# EAGLE design ESP07 Breakout (EAGLE 6.5.0)
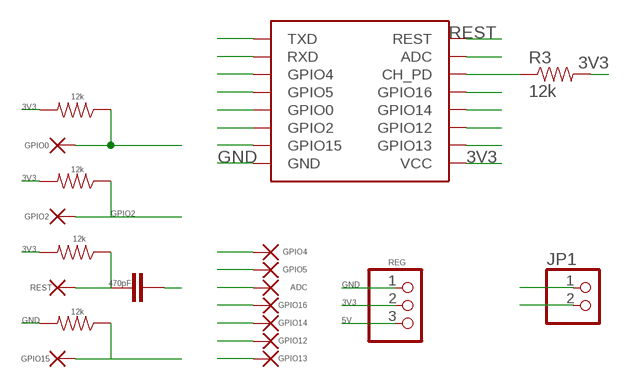
[diagram p0: schematic, sheet 1]

## Parts
ADC  1,6/0,8  [1,6/0,8]
C1  470pF  CAP0603-CAP  [0603-CAP]
GPIO0  1,6/0,8  [1,6/0,8]
GPIO2  1,6/0,8  [1,6/0,8]
GPIO4  1,6/0,8  [1,6/0,8]
GPIO5  1,6/0,8  [1,6/0,8]
GPIO12  1,6/0,8  [1,6/0,8]
GPIO13  1,6/0,8  [1,6/0,8]
GPIO14  1,6/0,8  [1,6/0,8]
GPIO15  1,6/0,8  [1,6/0,8]
GPIO16  1,6/0,8  [1,6/0,8]
JP1  PINHD-1X2/90  [1X02/90]
R1  12k  RESISTOR0603-RES  [0603-RES]
R2  12k  RESISTOR0603-RES  [0603-RES]
R3  12k  RESISTOR0603-RES  [0603-RES]
R4  12k  RESISTOR0603-RES  [0603-RES]
R5  12k  RESISTOR0603-RES  [0603-RES]
REG  PINHD-1X3  [1X03]
REST  1,6/0,8  [1,6/0,8]
U$1  ESP-07  [ESP-07]

## Nets
3V3: R1.2 R2.2 R3.2 R4.2 REG.2 U$1.VCC
5V: JP1.1 REG.3
ADC: ADC.1(P) U$1.ADC
GND: C1.2 JP1.2 R5.2 REG.1 U$1.GND
GPIO0: GPIO0.1(P) R1.1 U$1.GPIO00(GPIO0)
GPIO2: GPIO2.1(P) R2.1 U$1.GPIO2
GPIO4: GPIO4.1(P) U$1.GPIO4
GPIO5: GPIO5.1(P) U$1.GPIO5
GPIO12: GPIO12.1(P) U$1.GPIO12
GPIO13: GPIO13.1(P) U$1.GPIO13
GPIO14: GPIO14.1(P) U$1.GPIO14
GPIO15: GPIO15.1(P) R5.1 U$1.GPIO15
GPIO16: GPIO16.1(P) U$1.GPIO16
N$3: R3.1 U$1.CH_PD
REST: C1.1 R4.1 REST.1(P) U$1.REST
RXD: U$1.RXD
TXD: U$1.TXD

## Library data of the parts
ADC GPIO0 GPIO2 GPIO4 GPIO5 GPIO12-GPIO16 REST = wirepad:1,6/0,8: THROUGH-HOLE PAD
C1 = SparkFun-Passives:CAP: Capacitor Standard 0603 ceramic capacitor, and 0.1" leaded capacitor.
JP1 = pinhead:PINHD-1X2: PIN HEADER
R1-R5 = SparkFun-Passives:RESISTOR: Resistor Basic schematic elements and footprints for 0603, 1206, and PTH resistors.
REG = pinhead:PINHD-1X3: PIN HEADER
U$1 = Franc:ESP-07

## Board
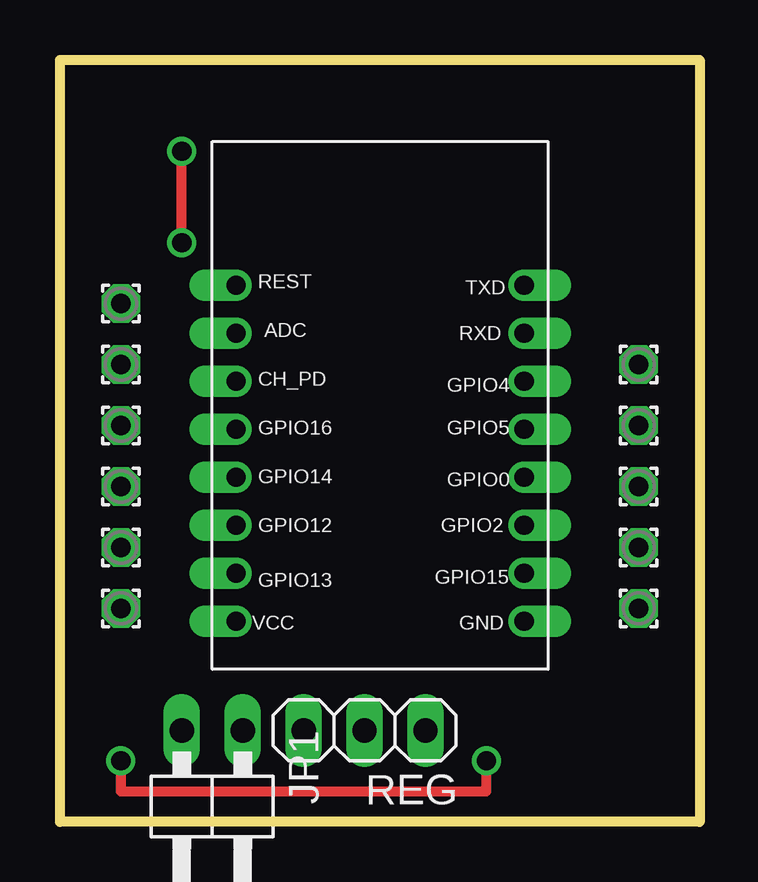
[diagram p1: board, top side]
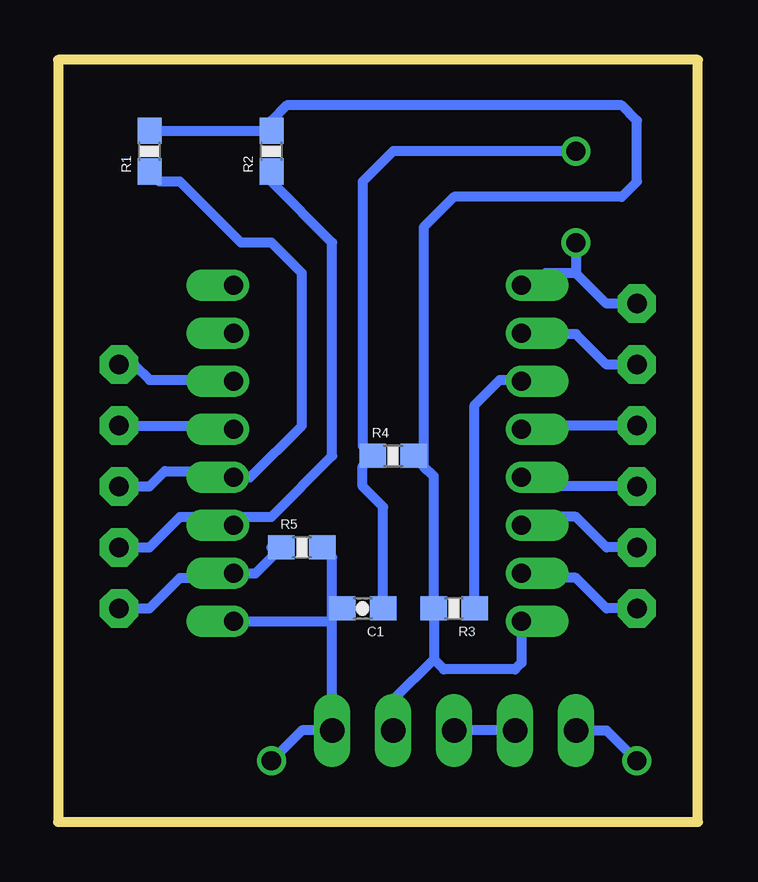
[diagram p2: board, bottom side, seen from below]

Size 26.59 x 31.74 mm. Coordinates in mm from the lower left corner, seen from the top.
Outline: 26.59,0 0,0 0,31.74 26.59,31.74
Copper layers (1*16): Top 0.035mm / dielectric 1.5mm / Bottom 0.035mm
Design rules "default": minimum track width 10mil, minimum drill 24mil, track to track 8mil, track to pad 8mil, pad to pad 8mil, via to via 8mil, smd to smd 8mil, copper to edge 40mil, drill to drill 8mil, minimum pad ring 10mil, minimum via ring 8mil, stop-mask expansion 4mil, vias tented up to drill 0mil, thermal gap 10mil
Milling: 4 lines

### Footprints (pad centres in the part's own frame; a part is rotated, then mirrored left to right if it is on the bottom)
1,6/0,8 = drill 0.813 pad 1.6 octagon: 1 0,0
0603-CAP = smd 1.1 x 1: 1 -0.85,0; 2 0.85,0
1X02/90 = drill 1.016 long: 1 -1.27,-3.81; 2 1.27,-3.81
0603-RES = smd 1.1 x 1: 1 -0.85,0; 2 0.85,0
1X03 = drill 1.016 long: 1 -2.54,0; 2 0,0; 3 2.54,0
ESP-07 = drill 0.8 offset: ADC 1,14; CH_PD 1,12; GND 13,2; GPIO00 13,8; GPIO2 13,6; GPIO4 13,12; GPIO5 13,10; GPIO12 1,6; GPIO13 1,4; GPIO14 1,8; GPIO15 13,4; GPIO16 1,10; REST 1,16; RXD 13,14; TXD 13,16; VCC 1,2

### Placement (x,y rotation side)
ADC  2.54,19.05 0 top
C1  13.97,8.89 180 bottom
GPIO0  24.13,13.97 0 top
GPIO2  24.13,11.43 0 top
GPIO4  24.13,19.05 0 top
GPIO5  24.13,16.51 0 top
GPIO12  2.54,11.43 0 top
GPIO13  2.54,8.89 0 top
GPIO14  2.54,13.97 0 top
GPIO15  24.13,8.89 0 top
GPIO16  2.54,16.51 0 top
JP1  6.35,0 180 top
R1  22.86,27.94 90 bottom
R2  17.78,27.94 90 bottom
R3  10.16,8.89 180 bottom
R4  12.7,15.24 0 bottom
R5  16.51,11.43 0 bottom
REG  12.7,3.81 180 top
REST  2.54,21.59 0 top
U$1  6.35,6.35 0 top

### Tracks (layer width: path | path; a pad name or v marks a point on that pad's centre or on a via)
3V3
  Bottom 0.406: 11.01,6.77 12.7,5.08 REG.2 | 11.01,6.77 R3.2 11.01,14.4 11.43,14.82 | U$1.VCC 7.35,6.62 7.62,6.35 10.59,6.35 11.01,6.77 | 11.43,14.82 R4.2 | 11.43,14.82 11.43,24.77 10.16,26.04 3.17,26.04 2.54,26.67 2.54,29.21 3.17,29.84 17.14,29.84 17.78,29.21 R2.2 R1.2
5V
  Bottom 0.406: JP1.1 REG.3
ADC
  Bottom 0.406: ADC.1 3.81,19.05 5.08,20.32 7.32,20.32 U$1.ADC
GND  (via drill 0.8)
  Top 0.406: v2.54,2.54 2.54,1.27 17.78,1.27 v17.78,2.54
  Bottom 0.406: 15.24,8.89 REG.1 16.51,3.81 v17.78,2.54 | 15.24,8.89 15.24,11.01 R5.2 | U$1.GND 15.36,8.35 C1.2 15.24,8.89 | JP1.2 3.81,3.81 v2.54,2.54
GPIO0
  Bottom 0.406: R1.1 22.44,26.67 21.59,26.67 19.05,24.13 17.78,24.13 16.51,22.86 16.51,16.51 18.67,14.35 U$1.GPIO00 19.61,14.61 22.23,14.61 22.86,13.97 GPIO0.1
GPIO2
  Bottom 0.406: GPIO2.1 22.86,11.43 21.59,12.7 19.7,12.7 | 19.7,12.7 U$1.GPIO2 | 19.7,12.7 17.78,12.7 15.24,15.24 15.24,24.13 17.78,26.67 R2.1
GPIO4
  Bottom 0.406: GPIO4.1 23.5,19.05 22.86,18.41 19.41,18.41 U$1.GPIO4
GPIO5
  Bottom 0.406: GPIO5.1 19.51,16.51 U$1.GPIO5
GPIO12
  Bottom 0.406: GPIO12.1 3.81,11.43 5.08,12.7 7,12.7 U$1.GPIO12
GPIO13
  Bottom 0.406: GPIO13.1 3.81,8.89 5.08,10.16 7.16,10.16 U$1.GPIO13
GPIO14
  Bottom 0.406: GPIO14.1 6.97,13.97 U$1.GPIO14
GPIO15
  Bottom 0.406: GPIO15.1 22.86,8.89 21.59,10.16 19.54,10.16 U$1.GPIO15 18.44,10.35 R5.1 17.78,11.43
GPIO16
  Bottom 0.406: GPIO16.1 7.19,16.51 U$1.GPIO16
N$3
  Bottom 0.406: R3.1 9.31,17.36 8.26,18.41 7.42,18.41 U$1.CH_PD
REST  (via drill 0.8)
  Top 0.406: v5.08,24.13 v5.08,27.94
  Bottom 0.406: REST.1 3.81,21.59 5.08,22.86 | 5.08,22.86 6.35,22.86 6.86,22.35 U$1.REST | C1.1 13.12,13.12 13.97,13.97 13.97,14.82 R4.1 13.97,15.66 13.97,26.67 12.7,27.94 v5.08,27.94 | v5.08,24.13 5.08,22.86